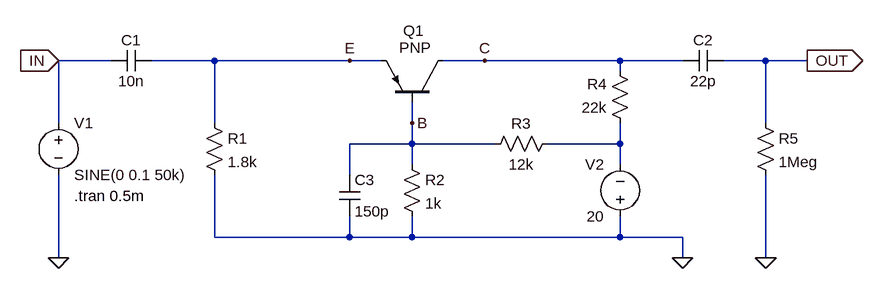
[diagram p0: schematic cb_amplifier_single_supply.asc]
cb_amplifier_single_supply.asc, the LTspice schematic file:
Version 4
SHEET 1 924 680
WIRE -256 80 -336 80
WIRE -96 80 -192 80
WIRE 112 80 -96 80
WIRE 160 80 112 80
WIRE 320 80 256 80
WIRE 528 80 320 80
WIRE 624 80 528 80
WIRE 752 80 688 80
WIRE 816 80 752 80
WIRE 528 96 528 80
WIRE -336 176 -336 80
WIRE -96 176 -96 80
WIRE 208 176 208 144
WIRE 752 176 752 80
WIRE 208 208 208 176
WIRE 208 208 112 208
WIRE 336 208 208 208
WIRE 528 208 528 176
WIRE 528 208 416 208
WIRE 208 240 208 208
WIRE 528 240 528 208
WIRE 112 256 112 208
WIRE -96 352 -96 256
WIRE 112 352 112 320
WIRE 112 352 -96 352
WIRE 208 352 208 320
WIRE 208 352 112 352
WIRE 528 352 528 320
WIRE 528 352 208 352
WIRE 624 352 528 352
WIRE -336 384 -336 256
WIRE 624 384 624 352
WIRE 752 384 752 256
FLAG 624 384 0
FLAG 816 80 OUT
IOPIN 816 80 Out
FLAG -336 80 IN
IOPIN -336 80 In
FLAG -336 384 0
FLAG 752 384 0
FLAG 208 176 B
FLAG 112 80 E
FLAG 320 80 C
SYMBOL pnp 256 144 M270
WINDOW 0 110 62 VLeft 2
WINDOW 3 84 68 VLeft 2
SYMATTR InstName Q1
SYMBOL res -112 160 R0
SYMATTR InstName R1
SYMATTR Value 1.8k
SYMBOL res 192 224 R0
SYMATTR InstName R2
SYMATTR Value 1k
SYMBOL res 432 192 R90
WINDOW 0 0 56 VBottom 2
WINDOW 3 32 56 VTop 2
SYMATTR InstName R3
SYMATTR Value 12k
SYMBOL res 544 192 R180
WINDOW 0 36 76 Left 2
WINDOW 3 36 40 Left 2
SYMATTR InstName R4
SYMATTR Value 22k
SYMBOL voltage -336 160 R0
WINDOW 123 0 0 Left 0
WINDOW 39 0 0 Left 0
SYMATTR InstName V1
SYMATTR Value SINE(0 0.1 50k)
SYMBOL voltage 528 336 R180
WINDOW 0 24 96 Left 2
WINDOW 3 24 16 Left 2
WINDOW 123 0 0 Left 0
WINDOW 39 0 0 Left 0
SYMATTR InstName V2
SYMATTR Value 20
SYMBOL cap -192 64 R90
WINDOW 0 0 32 VBottom 2
WINDOW 3 32 32 VTop 2
SYMATTR InstName C1
SYMATTR Value 10n
SYMBOL cap 688 64 R90
WINDOW 0 0 32 VBottom 2
WINDOW 3 32 32 VTop 2
SYMATTR InstName C2
SYMATTR Value 22p
SYMBOL res 736 160 R0
SYMATTR InstName R5
SYMATTR Value 1Meg
SYMBOL cap 96 256 R0
SYMATTR InstName C3
SYMATTR Value 150p
TEXT -312 288 Left 2 !.tran 0.5m

The netlist it stands for:
* cb_amplifier_single_supply.asc
Q1 C B E 0 PNP
R1 E 0 1.8k
R2 B 0 1k
R3 N001 B 12k
R4 N001 C 22k
V1 IN 0 SINE(0 0.1 50k)
V2 0 N001 20
C1 E IN 10n
C2 OUT C 22p
R5 OUT 0 1Meg
C3 B 0 150p
.model NPN NPN
.model PNP PNP
.lib standard.bjt
.tran 0.5m
.backanno
.end